# EAGLE schematic TeamI_PDSschematic (EAGLE 9.6.0)
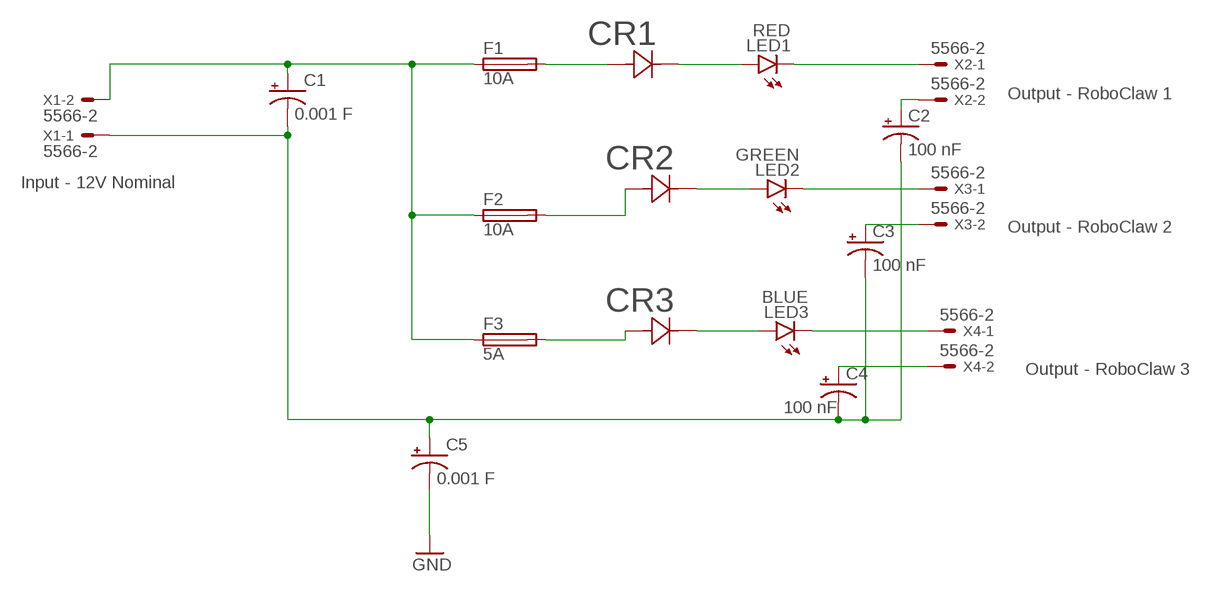
[diagram p0: schematic, sheet 1]

## Parts
C1  0.001 F  CPOL-USE2.5-6  [E2,5-6]
C2  100 nF  CPOL-USE2.5-6  [E2,5-6]
C3  100 nF  CPOL-USE2.5-6  [E2,5-6]
C4  100 nF  CPOL-USE2.5-6  [E2,5-6]
C5  0.001 F  CPOL-USE2.5-6  [E2,5-6]
CR1  SMAJ26A-E3/61  [DIODE_DO-214AC]
CR2  SMAJ26A-E3/61  [DIODE_DO-214AC]
CR3  SMAJ26A-E3/61  [DIODE_DO-214AC]
F1  10A  TE5  [TE5]
F2  10A  TE5  [TE5]
F3  5A  TE5  [TE5]
LED1  RED  LEDSMT1206  [1206]
LED2  GREEN  LEDSMT1206  [1206]
LED3  BLUE  LEDSMT1206  [1206]
X1  5566-2  [5566-2]
X2  5566-2  [5566-2]
X3  5566-2  [5566-2]
X4  5566-2  [5566-2]

## Nets
GND: C5.-
N$1: CR1.1 LED1.A
N$2: CR1.2 F1.2
N$3: CR3.1 LED3.A
N$4: LED1.C X2.1
N$5: CR2.2 F2.2
N$6: CR2.1 LED2.A
N$7: LED2.C X3.1
N$8: CR3.2 F3.2
N$9: LED3.C X4.1
N$10: C2.+ X2.2
N$11: C4.+ X4.2
N$12: C3.+ X3.2
N$13: C1.- C2.- C3.- C4.- C5.+ X1.1
N$14: C1.+ F1.1 F2.1 F3.1 X1.2

## Notes on the sheet
- Output - RoboClaw 1
- Input - 12V Nominal
- Output - RoboClaw 2
- Output - RoboClaw 3

## Library data of the parts
C1-C5 = rcl:CPOL-US: POLARIZED CAPACITOR, American symbol; SPICEPREFIX: C
CR1-CR3 = SMAJ26A-E3:SMAJ26A-E3/61; COPYRIGHT: Copyright (C) 2025 Ultra Librarian. All rights reserved.; MANUFACTURER_PART_NUMBER: SMAJ26A-E3/61; MFR_NAME: Vishay
F1-F3 = fuse:TE5: FUSE Wickmann; OC_FARNELL: unknown; OC_NEWARK: unknown
LED1-LED3 = led:LED: LED OSRAM: - CHIPLED LG R971, LG N971, LY N971, LG Q971, LY Q971, LO R971, LY R971 LH N974, LH R974 LS Q976, LO Q976, LY Q976 LO Q996 - Hyper CHIPLED LW Q18S LB Q993, LB Q99A, LB R99A - SideLED LS A670, LO A670, LY A670, LG A670, LP A670 LB A673, LV A673, LT A673, LW A673 LH A674 LY A675 LS A676, LA A676, LO A676, LY A676, LW A676 LS A679, LY A679, LG A679 - Hyper Micro SIDELED® LS Y876, LA Y876, LO Y876, LY Y876 LT Y87S - SmartLED LW L88C, LW L88S LB L89C, LB L89S, LG L890 LS L89K, LO L89K, LY L89K LS L896, LA L896, LO L896, LY L896 - TOPLED LS T670, LO T670, LY T670, LG T670, LP T670 LSG T670, LSP T670, LSY T670, LOP T670, LYG T670 LG T671, LOG T671, LSG T671 LB T673, LV T673, LT T673, LW T673 LH T674 LS T676, LA T676, LO T676, LY T676, LB T676, LH T676, LSB T676, LW T676 LB T67C, LV T67C, LT T67C, LS T67K, LO T67K, LY T67K, LW E67C LS E67B, LA E67B, LO E67B, LY E67B, LB E67C, LV E67C, LT E67C LW T67C LS T679, LY T679, LG T679 LS T770, LO T770, LY T770, LG T770, LP T770 LB T773, LV T773, LT T773, LW T773 LH T774 LS E675, LA E675, LY E675, LS T675 LS T776, LA T776, LO T776, LY T776, LB T776 LHGB T686 LT T68C, LB T68C - Hyper Mini TOPLED® LB M676 - Mini TOPLED Santana® LG M470 LS M47K, LO M47K, LY M47K Source: http://www.osram.convergy.de LUXEON: - LUMILED® LXK2-PW12-R00, LXK2-PW12-S00, LXK2-PW14-U00, LXK2-PW14-V00 LXK2-PM12-R00, LXK2-PM12-S00, LXK2-PM14-U00 LXK2-PE12-Q00, LXK2-PE12-R00, LXK2-PE12-S00, LXK2-PE14-T00, LXK2-PE14-U00 LXK2-PB12-K00, LXK2-PB12-L00, LXK2-PB12-M00, LXK2-PB14-N00, LXK2-PB14-P00, LXK2-PB14-Q00 LXK2-PR12-L00, LXK2-PR12-M00, LXK2-PR14-Q00, LXK2-PR14-R00 LXK2-PD12-Q00, LXK2-PD12-R00, LXK2-PD12-S00 LXK2-PH12-R00, LXK2-PH12-S00 LXK2-PL12-P00, LXK2-PL12-Q00, LXK2-PL12-R00 Source: www.luxeon.com KINGBRIGHT: KA-3528ASYC Source: www.kingbright.com
X1-X4 = con-molex:5566-2: Mini FIT connector 2 pol Source: http://www.molex.com; MF: MOLEX; OC_FARNELL: 1822072; OC_NEWARK: unknown